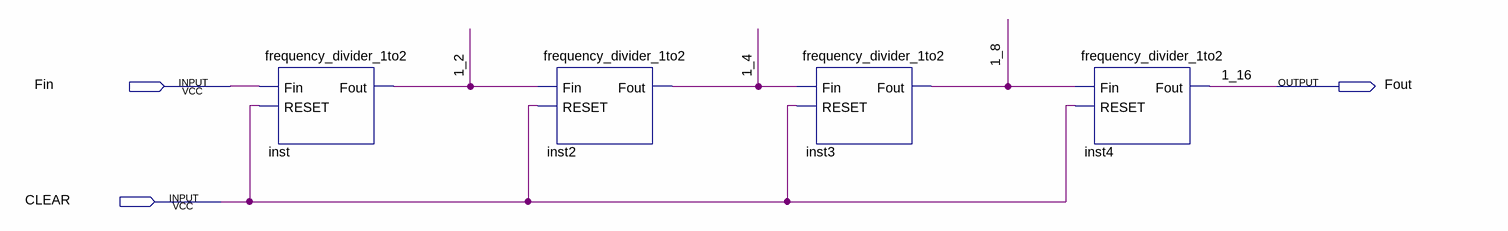
[diagram p0: schematic sheet]
// Quartus schematic frequency_divider_1_to_16.bdf as structural Verilog: 4 symbols, 3 pins
module frequency_divider_1_to_16 (
  input  Fin,
  input  CLEAR,
  output Fout
);

  wire \1_2 , \1_4 , \1_8 ;

  frequency_divider_1to2 inst (.Fin(Fin), .RESET(CLEAR), .Fout(\1_2 ));
  frequency_divider_1to2 inst2 (.Fin(\1_2 ), .RESET(CLEAR), .Fout(\1_4 ));
  frequency_divider_1to2 inst3 (.Fin(\1_4 ), .RESET(CLEAR), .Fout(\1_8 ));
  frequency_divider_1to2 inst4 (.Fin(\1_8 ), .RESET(CLEAR), .Fout(Fout));

  // Other names for the same wires on the sheet: 1_16 = Fout
endmodule
